# EAGLE board PoE_mag (EAGLE 6.4)
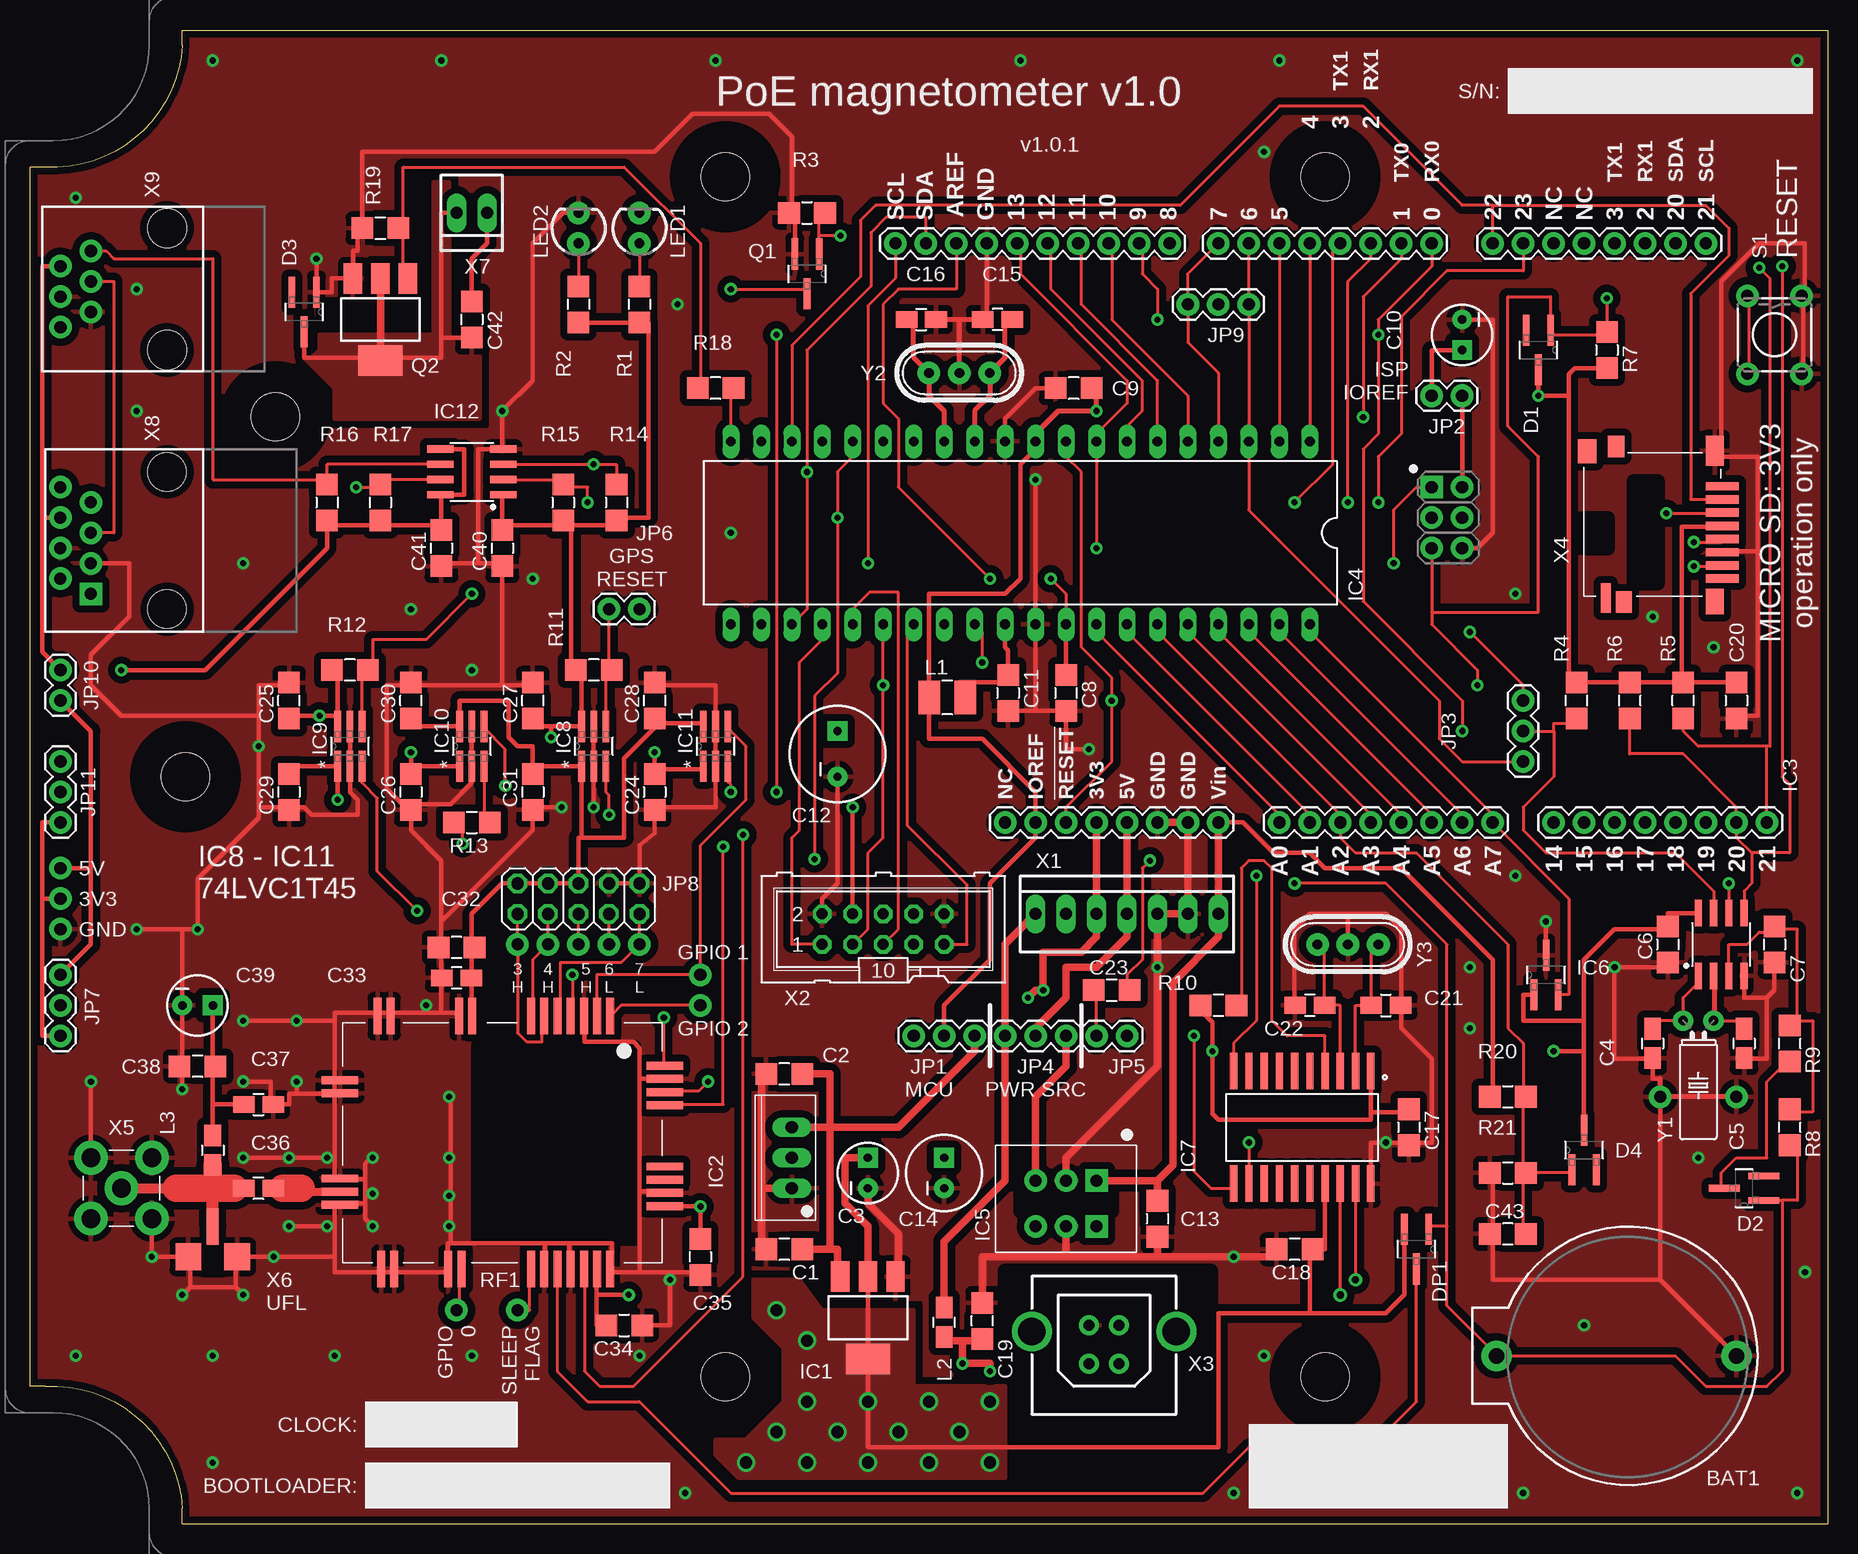
[diagram p3: board, top side]
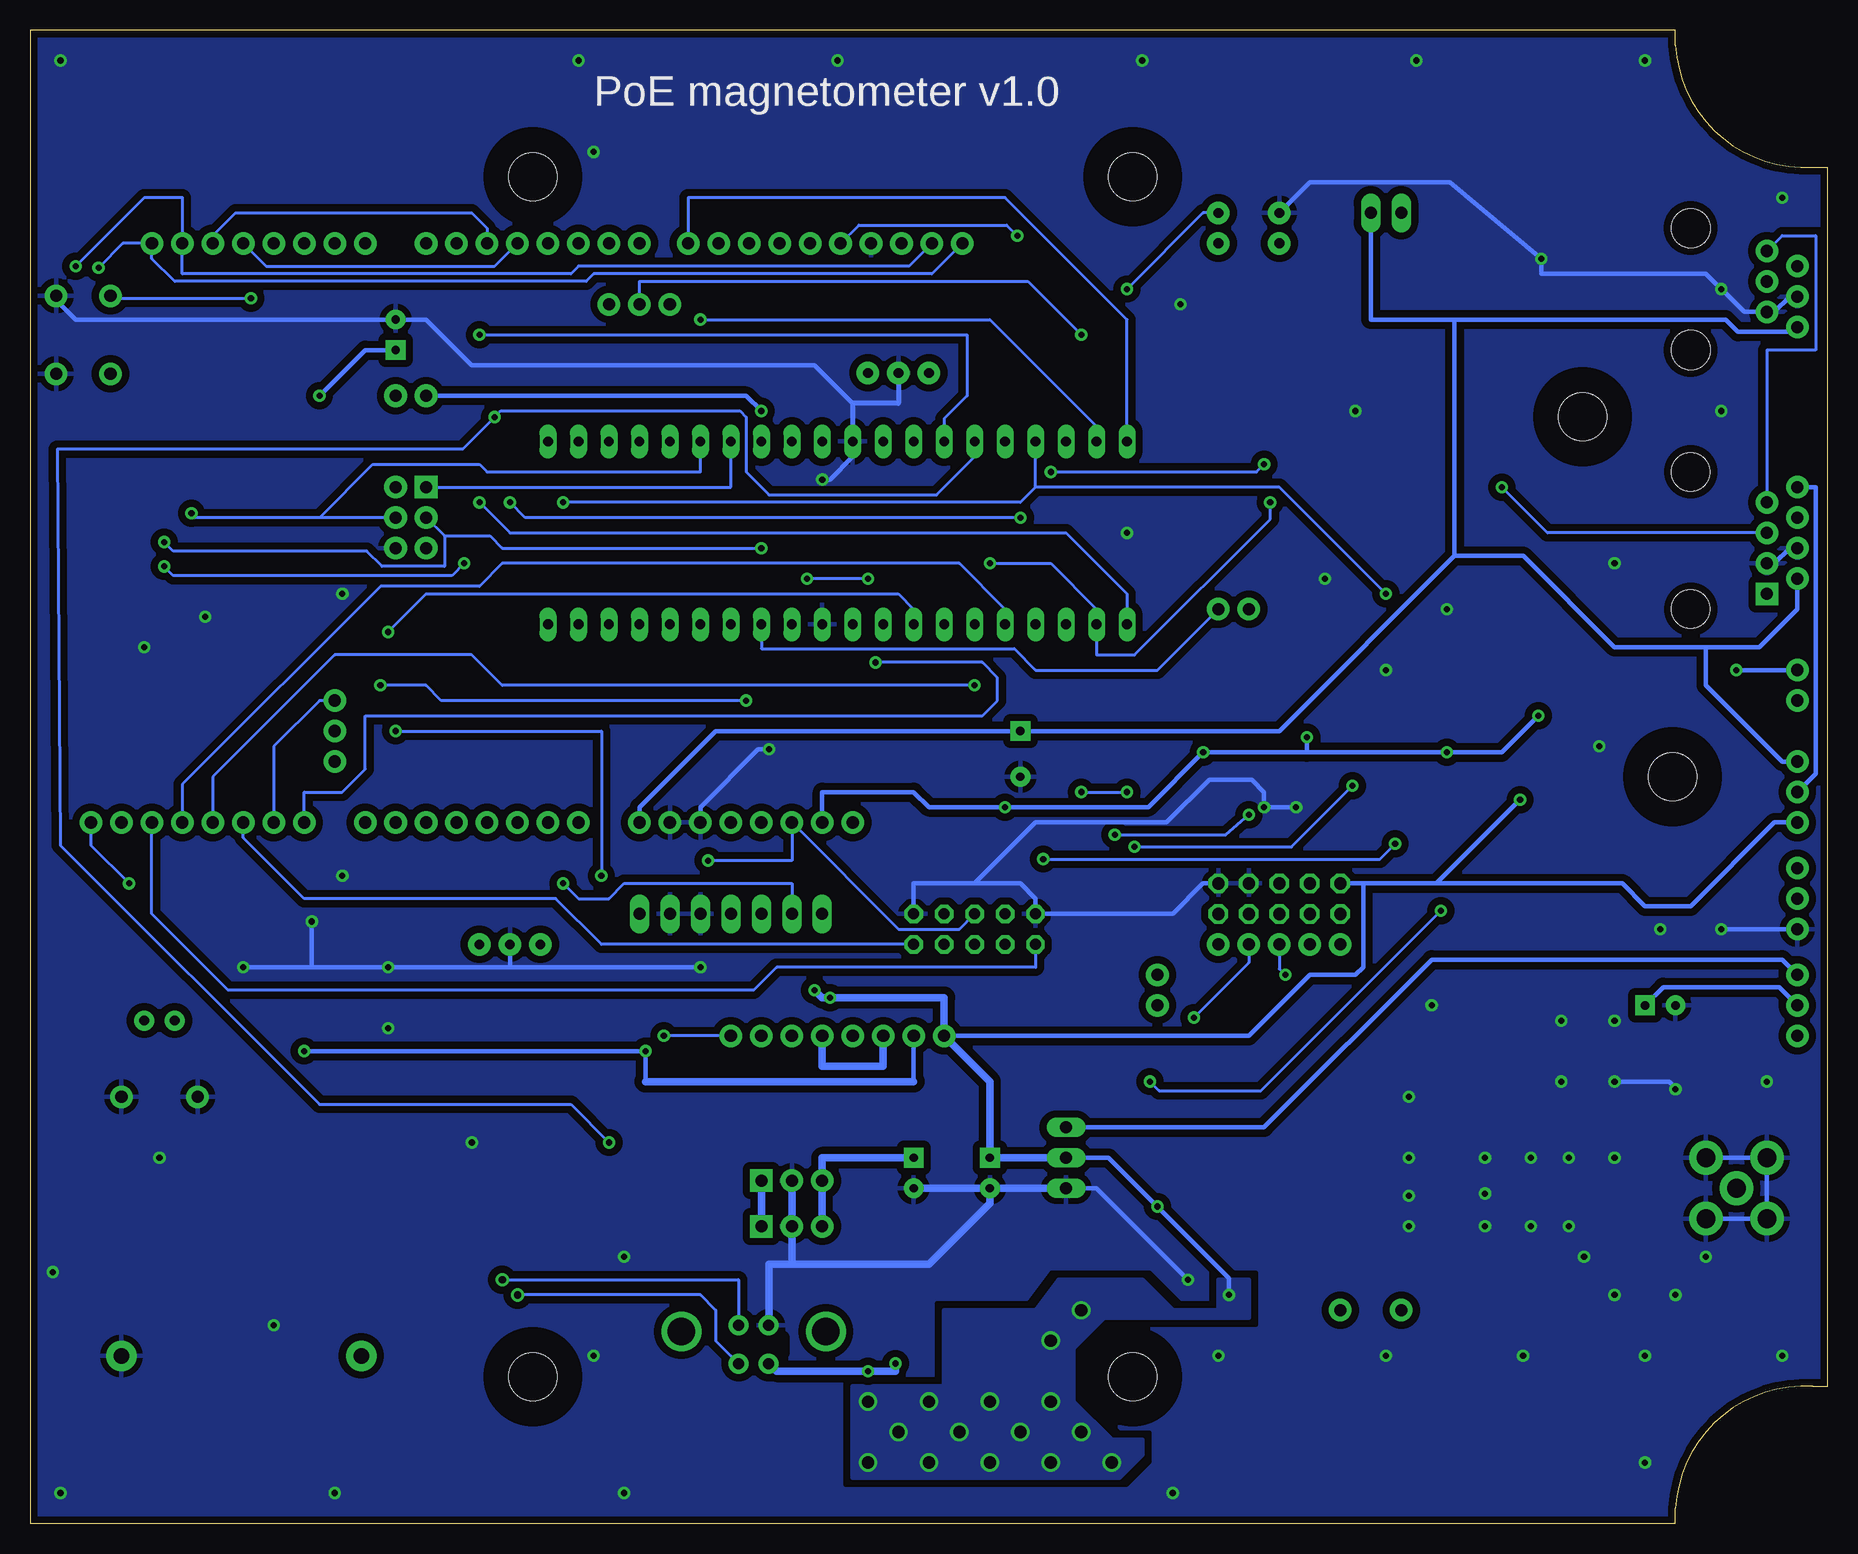
[diagram p4: board, bottom side, seen from below]

Size 149.86 x 124.46 mm. Coordinates in mm from the lower left corner, seen from the top.
Copper layers (1*16): Top 0.035mm / dielectric 1.5mm / Bottom 0.035mm
Design rules "SparkFun_Iteadstudio_10_12mil": minimum track width 10mil, minimum drill 20mil, track to track 12mil, track to pad 12mil, pad to pad 12mil, via to via 12mil, smd to smd 12mil, copper to edge 0.5mm, drill to drill 8mil, minimum pad ring 12mil, minimum via ring 10mil, stop-mask expansion 4mil, vias tented up to drill 25mil, thermal gap 20mil
Net classes: 1 power: width 0.381 mm; 2 antenna: width 0.66 mm
tRestrict: area 81.3,17.8 to 98.4,21.1; area 82.2,6.9 to 87,14; area 92.1,6.9 to 98.4,14; area 87,6.9 to 92.1,12.1; area 85.3,11.4 to 87.4,17.8; area 91.7,11.4 to 93.7,17.8; area 87.1,14.2 to 91.9,15.5; area 24.4,100.1 to 27.9,101.6; area 30.5,100.1 to 32.8,101.6
bRestrict: area 87.1,14.2 to 91.2,15.5

## Footprints (pad centres in the part's own frame; a part is rotated, then mirrored left to right if it is on the bottom)
BATTCOM_20MM_PTH = drill 1.3 pad 2.54: 1 20,0; 2 0,0
FIBOX-PC-M-95-G-POE-MAG = hole 4: 0,50; 0,-50; -50,-50; -50,50; -95,0; -87.5,30
1206-HAND = smd 1.8 x 1.803: 1 -1.499,0; 2 1.499,0
CPOL-RADIAL-10UF-25V = drill 0.7 pad 1.651 square: 1 1.27,0 | drill 0.7 pad 1.651: 2 -1.27,0
0805-HAND = smd 1.8 x 1.4: 1 -1.225,0; 2 1.225,0
CPOL-RADIAL-100UF-25V-150MIL = drill 0.7 pad 1.651 square: 1 1.905,0 | drill 0.7 pad 1.651: 2 -1.905,0
CPOL-RADIAL-100UF-16V = drill 0.7 pad 1.651 square: 1 1.27,0 | drill 0.7 pad 1.651: 2 -1.27,0
SOT23-3-HAND = smd 2.591 x 0.559: 1 -1.651,1.016; 2 -1.651,-1.016; 3 1.651,0
SOT223-HAND = smd 1.524 x 2.54: 1 -2.3,-3.429; 2 0,-3.429; 3 2.3,-3.429 | smd 3.683 x 2.54: 4 0,3.429
TO220 = drill 1.016 long: 1 -2.54,0; 2 0,0; 3 2.54,0
SO08 = smd 0.61 x 2.21: 1 -1.905,-2.616; 2 -0.635,-2.616; 3 0.635,-2.616; 4 1.905,-2.616; 5 1.905,2.616; 6 0.635,2.616; 7 -0.635,2.616; 8 -1.905,2.616
DIL40 = drill 0.813 long: 1 -24.13,-7.62; 2 -21.59,-7.62; 3 -19.05,-7.62; 4 -16.51,-7.62; 5 -13.97,-7.62; 6 -11.43,-7.62; 7 -8.89,-7.62; 8 -6.35,-7.62; 9 -3.81,-7.62; 10 -1.27,-7.62; 11 1.27,-7.62; 12 3.81,-7.62; 13 6.35,-7.62; 14 8.89,-7.62; 15 11.43,-7.62; 16 13.97,-7.62; 17 16.51,-7.62; 18 19.05,-7.62; 19 21.59,-7.62; 20 24.13,-7.62; 21 24.13,7.62; 22 21.59,7.62; 23 19.05,7.62; 24 16.51,7.62; 25 13.97,7.62; 26 11.43,7.62; 27 8.89,7.62; 28 6.35,7.62; 29 3.81,7.62; 30 1.27,7.62; 31 -1.27,7.62; 32 -3.81,7.62; 33 -6.35,7.62; 34 -8.89,7.62; 35 -11.43,7.62; 36 -13.97,7.62; 37 -16.51,7.62; 38 -19.05,7.62; 39 -21.59,7.62; 40 -24.13,7.62
TSR-1-XXXX/POWERPAX-P78XX-10 = drill 1 pad 1.88 square: 1@A -2.54,0; 1@B -2.54,3.81 | drill 1 pad 1.88: 2@A 0,0; 2@B 0,3.81; 3@A 2.54,0; 3@B 2.54,3.81
SO20 = smd 0.61 x 3.048: 1 -5.715,-4.699; 2 -4.445,-4.699; 3 -3.175,-4.699; 4 -1.905,-4.699; 5 -0.635,-4.699; 6 0.635,-4.699; 7 1.905,-4.699; 8 3.175,-4.699; 9 4.445,-4.699; 10 5.715,-4.699; 11 5.715,4.699; 12 4.445,4.699; 13 3.175,4.699; 14 1.905,4.699; 15 0.635,4.699; 16 -0.635,4.699; 17 -1.905,4.699; 18 -3.175,4.699; 19 -4.445,4.699; 20 -5.715,4.699
SOT23-6-HAND = smd 2.591 x 0.559: 1 -1.651,1.016; 2 -1.651,0; 3 -1.651,-1.016; 4 1.651,-1.016; 5 1.651,0; 6 1.651,1.016
1X03 = drill 1.016 pad 1.88: 1 0,0; 2 2.54,0; 3 5.08,0
1X02 = drill 1.016 pad 1.88: 1 0,0; 2 2.54,0
2X05 = drill 1.016 octagon: 1 -5.08,-1.27; 2 -5.08,1.27; 3 -2.54,-1.27; 4 -2.54,1.27; 5 0,-1.27; 6 0,1.27; 7 2.54,-1.27; 8 2.54,1.27; 9 5.08,-1.27; 10 5.08,1.27
1210-HAND = smd 1.8 x 2.794: 1 -1.499,0; 2 1.499,0
LED3MM = drill 0.813 pad 1.88: A -1.27,0; K 1.27,0
NVC08C-CSM-HAND = smd 0.66 x 3.048: P$1 -9,-10.535; P$2 -7.9,-10.535; P$3 -6.8,-10.535; P$4 -5.7,-10.535; P$5 -4.6,-10.535; P$6 -3.5,-10.535; P$7 -2.4,-10.535; P$8 2.5,-10.535; P$9 3.6,-10.535; P$10 9.3,-10.535; P$11 10.4,-10.535; P$17 10.1,10.535; P$18 9,10.535; P$19 4.5,10.535; P$20 3.4,10.535; P$21 -2.4,10.535; P$22 -3.5,10.535; P$23 -4.6,10.535; P$24 -5.7,10.535; P$25 -6.8,10.535; P$26 -7.9,10.535; P$27 -9,10.535 | smd 3.048 x 0.66: P$12 13.535,-5.2; P$13 13.535,-4.1; P$14 13.535,3; P$15 13.535,4.1; P$16 13.535,5.2; P$28 -13.535,5.3; P$29 -13.535,4.2; P$30 -13.535,3.1; P$31 -13.535,2; P$32 -13.535,-3.1; P$33 -13.535,-4.2; P$34 -13.535,-5.3; P$35 -13.535,-6.4
TACTILE-PTH = drill 1.016 pad 1.88: 1 -3.251,2.261; 2 3.251,2.261; 3 -3.251,-2.261; 4 3.251,-2.261
CALUNIUM-SHIELD-NO-OUTLINE-NO-HOLES-NO-TEXT-V3 = drill 1.016 pad 1.88: 0(RX0) 0,21.59; 1(TX0) -2.54,21.59; 2@0 -5.08,21.59; 2@1 17.78,21.59; 3.3V -27.94,-26.67; 3@0 -7.62,21.59; 3@1 15.24,21.59; 4 -10.16,21.59; 5 -12.7,21.59; 5V -25.4,-26.67; 6 -15.24,21.59; 7 -17.78,21.59; 8 -21.844,21.59; 9 -24.384,21.59; 10 -26.924,21.59; 11@0 -29.464,21.59; 12@0 -32.004,21.59; 13@0 -34.544,21.59; 14 10.16,-26.67; 15 12.7,-26.67; 16 15.24,-26.67; 17 17.78,-26.67; 18 20.32,-26.67; 19 22.86,-26.67; 20@0 25.4,-26.67; 20@1 20.32,21.59; 21@0 27.94,-26.67; 21@1 22.86,21.59; 22 5.08,21.59; 23 7.62,21.59; !ISP_RESET 0,-3.81; !RESET@0 -30.48,-26.67; A0 -12.7,-26.67; A1 -10.16,-26.67; A2 -7.62,-26.67; A3 -5.08,-26.67; A4/SDA -2.54,-26.67; A5/SCL 0,-26.67; A6 2.54,-26.67; A7 5.08,-26.67; AREF -39.624,21.59; GND@0 -22.86,-26.67; GND@1 -20.32,-26.67; GND@2 -37.084,21.59; GND@3 2.54,-3.81; IOREF -33.02,-26.67; ISP_MOSI 2.54,-1.27; ISP_SCK 0,-1.27; ISP_VCC 2.54,1.27; NC -35.56,-26.67; NC@0 12.7,21.59; NC@1 10.16,21.59; SCL -44.704,21.59; SDA -42.164,21.59; VIN -17.78,-26.67 | drill 1.016 pad 1.88 square: ISP_MISO 0,1.27
PAD = drill 1.016 pad 1.88: 1 0,0
22-23-2071 = drill 1 long: 1 -7.62,0; 2 -5.08,0; 3 -2.54,0; 4 0,0; 5 2.54,0; 6 5.08,0; 7 7.62,0
CON-HARTING-ML10 = drill 0.914 octagon: 1 -5.08,-1.27; 2 -5.08,1.27; 3 -2.54,-1.27; 4 -2.54,1.27; 5 0,-1.27; 6 0,1.27; 7 2.54,-1.27; 8 2.54,1.27; 9 5.08,-1.27; 10 5.08,1.27
USB-B-PTH-VERTICAL = drill 0.92 pad 1.676: D+ -1.25,0; D- -1.25,3.2; GND 1.25,0; VBUS 1.25,3.2 | drill 2.3: P$1 -6.02,0.5; P$2 6.02,0.5
MICRO-SD-SOCKET-HIROSE-DM3D = smd 0.7 x 2.75: CD/DAT3 6.6,-1.375; CLK 3.3,-1.375; CMD 5.5,-1.375; DAT0 1.1,-1.375; DAT1 0,-1.375; DAT2 7.7,-1.375; GND 2.2,-1.375; VDD 4.4,-1.375 | smd 1.8 x 1.3: P$11 -1.95,6.85 | smd 2.45 x 0.8: P$12 -1.625,8.35 | smd 1.8 x 1.4: P$13 11,7.5 | smd 2 x 1.55: P$14 10.6,9.925 | smd 2.5 x 1.5: SHIELD@0 10.65,-0.75 | smd 2.1 x 1.5: SHIELD@1 -1.9,-0.75
SMA-THD = drill 1.549 pad 2.794: GND@0 -2.54,2.54; GND@1 2.54,2.54; GND@2 2.54,-2.54; GND@3 -2.54,-2.54; SIG 0,0
CONN-UFL-HAND-SOLDERING = smd 2.134 x 2.235: GND@0 -2.032,0; GND@1 2.032,0 | smd 1.016 x 3.048: SIGNAL 0,-2.54
22-23-2021 = drill 1 long: 1 -1.27,0; 2 1.27,0
RJ45-8 = drill 1 pad 1.88 square: 1 -4.445,6.35 | drill 1 pad 1.88: 2 -3.175,8.89; 3 -1.905,6.35; 4 -0.635,8.89; 5 0.635,6.35; 6 1.905,8.89; 7 3.175,6.35; 8 4.445,8.89 | hole 3.2: -5.715,0; 5.715,0
RJ11-6 = drill 1.016 pad 1.88: 1 1.905,8.89; 2 3.175,6.35; 3 4.445,8.89; 4 5.715,6.35; 5 6.985,8.89; 6 8.255,6.35 | hole 3.251: 0,0; 10.16,0
TC38H = drill 0.813 pad 1.676: 1 -1.27,0; 2 1.27,0
HC49U-V-RESONATOR = drill 0.813 pad 1.88: 1 -2.54,0; 2 2.54,0; GND 0,0

## Placement (x,y rotation side)
BAT1  CR2032  [BATTCOM_20MM_PTH]  142.24,13.97 180 top
BOX1  BOXPOE-MAG-150-150  [FIBOX-PC-M-95-G-POE-MAG]  107.95,62.23 0 top
C1  1u  [1206-HAND]  62.87,22.86 180 top
C2  1u*  [1206-HAND]  62.87,37.46 180 top
C3  10u  [CPOL-RADIAL-10UF-25V]  69.85,29.21 90 top
C4  15p*  [0805-HAND]  135.25,40 270 top
C5  15p*  [0805-HAND]  142.88,40 270 top
C6  100n  [1206-HAND]  136.53,48.26 270 top
C7  100p*  [1206-HAND]  145.41,48.26 270 top
C8  100n  [1206-HAND]  86.36,69.22 270 top
C9  100n  [1206-HAND]  87,94.62 180 top
C10  10u  [CPOL-RADIAL-10UF-25V]  119.38,99.06 270 top
C11  100n  [1206-HAND]  81.53,69.22 270 top
C12  100u 25V  [CPOL-RADIAL-100UF-25V-150MIL]  67.31,64.13 90 top
C13  1u  [1206-HAND]  93.98,25.4 270 top
C14  100u  [CPOL-RADIAL-100UF-16V]  76.2,29.21 90 top
C15  22p  [0805-HAND]  80.64,100.33 180 top
C16  22p  [0805-HAND]  74.3,100.33 0 top
C17  100n  [1206-HAND]  114.94,33.02 270 top
C18  100n  [1206-HAND]  105.41,22.86 180 top
C19  10n  [1206-HAND]  79.38,16.89 90 top
C20  100n  [1206-HAND]  142.24,68.58 270 top
C21  22p  [0805-HAND]  113.03,43.18 0 top
C22  22p  [0805-HAND]  106.68,43.18 180 top
C23  100n  [1206-HAND]  90.17,44.45 0 top
C24  100n  [1206-HAND]  52.07,60.96 270 top
C25  100n  [1206-HAND]  21.59,68.58 90 top
C26  100n  [1206-HAND]  31.75,60.96 270 top
C27  100n  [1206-HAND]  41.91,68.58 90 top
C28  100n  [1206-HAND]  52.07,68.58 90 top
C29  100n  [1206-HAND]  21.59,60.96 270 top
C30  100n  [1206-HAND]  31.75,68.58 90 top
C31  100n  [1206-HAND]  41.91,60.96 270 top
C32  1u  [1206-HAND]  35.56,48.01 180 top
C33  22p  [0805-HAND]  35.56,45.47 180 top
C34  1u  [1206-HAND]  49.53,16.51 0 top
C35  1u  [1206-HAND]  55.88,22.22 270 top
C36  22p  [0805-HAND]  19.05,27.94 180 top
C37  22p  [0805-HAND]  19.05,34.92 0 top
C38  1u  [1206-HAND]  13.97,38.1 180 top
C39  10u  [CPOL-RADIAL-10UF-25V]  13.97,43.18 0 top
C40  100n  [1206-HAND]  39.37,81.28 270 top
C41  100n  [1206-HAND]  34.29,81.28 270 top
C42  1u  [1206-HAND]  36.83,100.33 270 top
C43  100n  [1206-HAND]  123.19,24.13 180 top
D1  BAS40  [SOT23-3-HAND]  125.73,97.79 270 top
D2  BAS40*  [SOT23-3-HAND]  142.88,27.94 180 top
D3  BAS21  [SOT23-3-HAND]  22.86,100.97 270 top
D4  BAS40  [SOT23-3-HAND]  129.54,31.11 90 top
DP1  BAS40-05  [SOT23-3-HAND]  115.57,22.86 270 top
IC1  LD1117V33  [SOT223-HAND]  69.85,17.14 180 top
IC2  LD1117V33*  [TO220]  63.5,30.48 90 top
IC3  DS1338  [SO08]  140.97,48.26 0 top
IC4  ATMEGA1284  [DIL40]  82.55,82.55 180 top
IC5  TSR 1-2450  [TSR-1-XXXX/POWERPAX-P78XX-10]  86.36,28.57 180 top
IC6  LM61  [SOT23-3-HAND]  126.36,45.72 90 top
IC7  MCP2200  [SO20]  106.05,33.02 180 top
IC8  74LVC1T45SOT23-HAND  [SOT23-6-HAND]  46.99,64.77 90 top
IC9  74LVC1T45SOT23-HAND  [SOT23-6-HAND]  26.67,64.77 90 top
IC10  74LVC1T45SOT23-HAND  [SOT23-6-HAND]  36.83,64.77 90 top
IC11  74LVC1T45SOT23-HAND  [SOT23-6-HAND]  57.15,64.77 90 top
IC12  PCA9517A  [SO08]  36.83,87.63 90 top
JP1  3V3/5V  [1X03]  73.66,40.64 0 top
JP2  ISP IOREF  [1X02]  119.38,93.98 180 top
JP3  SQW  [1X03]  124.46,68.58 270 top
JP4  USB/VIN  [1X03]  86.36,40.64 180 top
JP5  AUTO RST  [1X02]  91.44,40.64 180 top
JP6  GPS !RESET! (A0)  [1X02]  50.8,76.2 180 top
JP7  V ANT  [1X03]  2.54,45.72 270 top
JP8  CONFIG  [2X05]  45.72,52.07 0 top
JP9  PPS  [1X03]  96.52,101.6 0 top
JP10  5V LINK  [1X02]  2.54,68.58 90 top
JP11  MAG VCC  [1X03]  2.54,63.5 270 top
L1  10uH  [1210-HAND]  76.45,68.83 180 top
L2  FERRITE  [0805-HAND]  76.2,16.76 90 top
L3  47n  [0805-HAND]  15.24,31.11 270 top
LED1  D13  [LED3MM]  50.8,107.95 90 top
LED2  PWR  [LED3MM]  45.72,107.95 90 top
Q1  BSS138  [SOT23-3-HAND]  64.77,104.14 270 top
Q2  BUK98150-55A  [SOT223-HAND]  29.21,100.33 180 top
R1  560R  [1206-HAND]  50.8,101.6 270 top
R2  560R  [1206-HAND]  45.72,101.6 270 top
R3  1M  [1206-HAND]  64.77,109.22 0 top
R4  10k  [1206-HAND]  128.91,68.58 90 top
R5  4k7  [1206-HAND]  137.79,68.58 90 top
R6  4k7  [1206-HAND]  133.35,68.58 90 top
R7  10k  [1206-HAND]  131.44,97.79 270 top
R8  0R  [1206-HAND]  146.69,33.02 90 top
R9  1k*  [1206-HAND]  146.69,40 90 top
R10  1k  [1206-HAND]  99.06,43.18 180 top
R11  10k  [1206-HAND]  46.99,71.12 180 top
R12  100k  [1206-HAND]  26.67,71.12 180 top
R13  10k  [1206-HAND]  36.83,58.42 0 top
R14  4k7  [1206-HAND]  48.9,85.09 270 top
R15  4k7  [1206-HAND]  44.45,85.09 270 top
R16  4k7  [1206-HAND]  24.77,85.09 270 top
R17  4k7  [1206-HAND]  29.21,85.09 270 top
R18  330R  [1206-HAND]  57.15,94.62 180 top
R19  1M  [1206-HAND]  29.21,107.95 0 top
R20  3k 1%  [1206-HAND]  123.19,35.56 0 top
R21  1k 1%  [1206-HAND]  123.19,29.21 0 top
RF1  NV08C-CSM  [NVC08C-CSM-HAND]  39.37,31.75 180 top
S1  RESET  [TACTILE-PTH]  145.41,99.06 270 top
U$1  CALUNIUM-SHIELD-V3V3-NO-HOLES-NO-TEXT  [CALUNIUM-SHIELD-NO-OUTLINE-NO-HOLES-NO-TEXT-V3]  116.84,85.09 0 top
U$2  PAD  [PAD]  2.54,49.53 0 top
U$3  PAD  [PAD]  2.54,52.07 0 top
U$4  PAD  [PAD]  2.54,54.61 0 top
U$5  PAD  [PAD]  40.64,17.78 270 top
U$6  PAD  [PAD]  35.56,17.78 270 top
U$7  PAD  [PAD]  55.88,45.72 270 top
U$8  ?  [PAD]  55.88,43.18 270 top
U$9  PAD  [PAD]  40.64,48.26 270 top
U$10  PAD  [PAD]  43.18,48.26 270 top
U$11  PAD  [PAD]  45.72,48.26 270 top
U$12  PAD  [PAD]  48.26,48.26 270 top
U$13  PAD  [PAD]  50.8,48.26 270 top
U$14  PAD  [PAD]  142.24,35.56 0 top
U$15  PAD  [PAD]  135.89,35.56 0 top
X1  PWR  [22-23-2071]  91.44,50.8 0 top
X2  JTAG  [CON-HARTING-ML10]  71.12,49.53 0 top
X3  USB  [USB-B-PTH-VERTICAL]  89.53,16.51 180 top
X4  MICRO-SD-SOCKETHIROSE-DM3D  [MICRO-SD-SOCKET-HIROSE-DM3D]  139.7,78.74 90 top
X5  CONN-SMATHD  [SMA-THD]  7.62,27.94 270 top
X6  UFL  [CONN-UFL-HAND-SOLDERING]  15.24,22.22 180 top
X7  22-23-2021  [22-23-2021]  36.83,109.22 180 top
X8  RJ45*  [RJ45-8]  11.43,81.91 90 top
X9  RJ11  [RJ11-6]  11.43,97.79 90 top
Y1  32k768  [TC38H]  139.06,41.91 180 top
Y2  12MHz  [HC49U-V-RESONATOR]  77.47,95.88 180 top
Y3  12MHz  [HC49U-V-RESONATOR]  109.86,48.26 180 top

## Tracks (layer width: path | path; a pad name or v marks a point on that pad's centre or on a via)
0(RX0)  (via drill 0.51)
  Top 0.254: U$1.0(RX0) 116.84,104.78 112.39,100.33 v112.39,99.06 112.39,90.81 111.12,89.53 111.12,76.84 119.38,68.58 v119.38,66.04 | IC7.10 100.33,40 102.23,41.91 v102.23,53.97
  Bottom 0.254: IC4.14 73.66,92.07 71.75,93.98 71.75,99.06 v112.39,99.06 | v102.23,53.97 102.23,66.04 v119.38,66.04
1(TX0)  (via drill 0.51)
  Top 0.254: v111.12,92.2 111.12,102.23 114.3,105.41 U$1.1(TX0) | v101.6,31.75 IC7.12
  Bottom 0.254: IC4.15 71.12,88.9 74.3,85.72 88.27,85.72 90.17,87.63 90.17,92.2 90.68,92.71 110.62,92.71 v111.12,92.2 113.79,89.53 147.57,89.53 147.32,56.51 125.73,34.92 104.78,34.92 v101.6,31.75
2(RX1)  (via drill 0.51)
  Top 0.254: v36.07,56.64 36.07,57.91 35.56,58.42 R13.1 | v65.41,55.37 65.41,68.96 67.31,70.87 v67.31,83.82 67.31,87.63 68.58,88.9 IC4.16 | U$1.2@0 111.76,105.41 109.86,103.5 v109.86,85.09
  Bottom 0.254: U$1.2@0 111.76,107.95 113.03,109.22 132.72,109.22 134.62,107.31 U$1.2@1 | v36.07,56.64 37.34,55.37 v65.41,55.37 | v109.86,85.09 108.58,83.82 v67.31,83.82
3(TX1)  (via drill 0.51)
  Top 0.254: 27.94,71.12 27.69,70.87 IC9.4 | v36.83,77.47 33.02,73.66 28.57,73.66 28.57,71.12 R12.1 | U$1.3@0 108.58,106.04 108.58,88.26 v105.41,85.09
  Top 0.381: R12.1 27.94,71.12
  Bottom 0.254: U$1.3@0 111.12,104.78 130.18,104.78 U$1.3@1 | 66.04,86.36 IC4.17 | 66.04,86.36 45.72,86.36 v36.83,77.47 | v105.41,85.09 67.31,85.09 66.04,86.36
4
  Top 0.254: U$1.4 IC4.1
5
  Top 0.254: U$1.5 IC4.2
6
  Top 0.254: U$1.6 JP9.3 IC4.3 101.6,84.45 117.47,68.58 117.47,65.41 119.38,63.5 JP3.3
7
  Top 0.254: IC4.4 99.06,95.88 96.52,98.42 JP9.1 96.52,104.14 U$1.7
8
  Top 0.254: IC4.20 58.42,94.49 R18.1
  Bottom 0.254: U$1.8 95,110.49 68.58,110.49 58.42,100.33 IC4.20
9  (via drill 0.51)
  Top 0.254: U$1.9 92.71,106.43 92.71,104.14 93.98,102.87 v93.98,100.33
  Bottom 0.254: IC4.19 60.96,91.44 69.85,100.33 v93.98,100.33
10
  Top 0.254: IC4.5 96.52,93.98 90.17,100.33 90.17,106.43 U$1.10
11(MOSI)  (via drill 0.51)
  Top 0.254: v136.4,84.2 140.97,84.2 X4.CMD | U$1.11@0 87.63,106.43 87.63,101.6 93.98,95.25 IC4.6
  Bottom 0.254: v136.4,84.2 136.14,83.82 125.73,83.82 | U$1.ISP_MOSI 125.73,83.82 | IC4.6 93.98,87.63 111.76,87.63 112.39,88.26 121.28,88.26 125.73,83.82
12(MISO)  (via drill 0.51)
  Top 0.254: v138.68,79.76 140.97,79.76 X4.DAT0 | v113.67,80.01 113.67,84.45 115.57,86.36 U$1.ISP_MISO | U$1.12@0 85.09,106.43 85.09,102.87 92.71,95.25 92.71,92.71 91.44,91.44 IC4.7
  Bottom 0.254: v138.68,79.76 137.92,78.99 114.68,78.99 v113.67,80.01 | IC4.7 91.44,86.36 U$1.ISP_MISO
13(SCK)  (via drill 0.51)
  Top 0.254: v138.68,81.79 140.97,81.79 X4.CLK | Q1.1 65.79,107.31 | U$1.13@0 82.55,106.43 82.55,104.14 91.44,95.25 91.44,93.34 88.9,90.81 IC4.8 v88.9,81.28 | v67.56,107.31 65.79,107.31 | 65.79,107.31 65.79,109.22 R3.2
  Bottom 0.254: v138.68,81.79 137.92,81.03 121.79,81.03 120.52,79.76 115.32,79.76 115.32,82.3 | v67.56,107.31 68.45,108.2 80.77,108.2 U$1.13@0 | 115.32,82.3 111.51,82.3 110.49,81.28 v88.9,81.28 | 115.32,82.3 U$1.ISP_SCK
14  (via drill 0.51)
  Top 0.254: IC4.29 79.38,74.29 v79.38,71.75
  Bottom 0.254: v79.38,71.75 70.48,71.75 69.22,70.48 69.22,68.58 70.48,67.31 121.92,67.31 121.92,62.86 123.83,60.96 127,60.96 U$1.14
15  (via drill 0.51)
  Top 0.254: JP3.1 124.46,69.85 v120.02,74.29
  Bottom 0.254: IC4.28 76.2,76.2 77.47,77.47 116.84,77.47 v120.02,74.29 | U$1.15 129.54,64.77 125.73,68.58 JP3.1
16(TDI)
  Top 0.254: IC4.27 73.15,74.42 73.15,58.17 78.11,53.21 78.11,48.26 X2.9
  Bottom 0.254: U$1.16 132.08,57.15 127,52.07 106.05,52.07 102.23,48.26 X2.9
17(TDO)  (via drill 0.51)
  Top 0.254: IC4.26 v71.12,69.85 71.12,57.15 69.85,55.88 69.85,49.53 X2.3
  Bottom 0.254: U$1.17 134.62,62.23 124.46,72.39 113.03,72.39 110.49,69.85 v71.12,69.85
18(TMS)
  Top 0.254: IC4.25 68.58,76.2 69.98,77.6 72.39,77.6 72.39,49.53 X2.5
  Bottom 0.254: U$1.18 137.16,61.59 120.65,78.1 112.39,78.1 110.49,80.01 72.39,80.01 68.58,76.2 IC4.25
19(TCK)
  Top 0.254: IC4.24 66.04,73.66 64.14,71.75 64.14,57.78 63.5,57.15 63.5,48.26 X2.1
  Bottom 0.254: U$1.19 139.7,50.8 133.35,44.45 89.53,44.45 87.63,46.35 66.04,46.35 X2.1
20(SDA)  (via drill 0.51)
  Top 0.254: 133.35,67.31 R6.1 133.35,64.13 137.79,64.13 142.24,59.69 U$1.20@0 142.24,57.15 143.51,55.88 | 143.51,55.88 143.51,53.34 142.88,52.7 IC3.5 | IC12.3 v46.99,88.26 48.9,88.26 48.9,86.61 48.26,86.61 R14.1 | IC4.23 64.77,76.2 v64.77,87.63 64.77,97.79 70.1,103.12 70.1,107.57 71.37,108.84 74.68,108.84 U$1.SDA | 143.51,55.88 146.69,55.88 146.69,61.59 146.05,62.23 v146.05,104.78
  Bottom 0.254: U$1.SDA 76.58,104.78 104.14,104.78 104.78,104.14 137.16,104.14 U$1.20@1 137.16,110.49 140.34,110.49 v146.05,104.78 | v46.99,88.26 47.62,87.63 v64.77,87.63
21(SCL)  (via drill 0.51)
  Top 0.254: U$1.21@0 144.78,64.77 | 144.78,64.77 139.06,64.77 137.79,66.04 R5.1 | v141.6,53.34 141.6,50.8 141.73,51.05 IC3.6 | IC12.2 39.62,86.87 39.62,87 44.45,87 R15.1 44.45,86.36 46.48,86.36 v46.48,85.09 | v69.85,80.01 69.85,101.47 72.14,103.76 U$1.SCL | 144.78,64.77 145.03,64.77 145.03,103.76 v144.15,104.65
  Bottom 0.254: U$1.21@0 144.78,56.51 v141.6,53.34 | v69.85,80.01 64.77,80.01 60.96,76.2 IC4.22 60.96,72.39 57.78,72.39 46.48,83.69 v46.48,85.09 | U$1.SCL 74.68,104.14 102.87,104.14 103.5,103.5 137.79,103.5 139.7,105.41 U$1.21@1 142.11,106.68 v144.15,104.65
22
  Top 0.254: 121.92,109.85 139.7,109.85 141.6,107.95 141.6,105.66 138.43,102.49 138.43,85.34 140.97,85.34 X4.CD/DAT3 | U$1.22 121.92,109.85 | IC4.18 63.5,98.17 69.22,103.89 69.22,108.59 70.48,109.85 95.89,109.85 104.14,118.11 111.12,118.11 119.38,109.85 121.92,109.85
23  (via drill 0.51)
  Top 0.254: v112.39,85.09 112.39,88.9 114.3,90.81 114.3,100.58 118.11,104.39 124.46,104.39 U$1.23
  Bottom 0.254: IC4.21 58.42,77.47 63.5,82.55 109.86,82.55 v112.39,85.09
!GPS_RESET  (via drill 0.51)
  Top 0.254: v48.26,59.05 48.26,60.71 48.01,60.96 IC8.3 | v59.44,57.4 59.44,20.57 50.29,11.43 47.5,11.43 46.23,12.7 46.23,21.08 RF1.P$25
  Bottom 0.254: v48.26,59.05 50.16,57.4 v59.44,57.4
!MCP2200_RESET
  Top 0.254: R10.1 100.97,43.18 100.97,54.61 101.6,55.24 102.87,55.24 103.5,54.61 103.5,41.91 104.78,40.64 107.95,40.64 IC7.4
!RESET  (via drill 0.51)
  Top 0.254: v131.44,102.11 R7.1 131.44,99.06 126.75,99.06 D1.1 126.75,102.23 123.19,102.23 123.19,91.44 125.73,88.9 125.73,75.95 116.84,75.95 | S1.4 143.26,96.01 143.26,102.11 S1.3 | v93.34,55.24 92.71,54.61 92.71,46.99 91.44,45.72 91.44,43.81 C23.2 | IC4.9 86.36,88.9 87.63,87.63 87.63,73.03 90.17,70.48 v90.17,68.58 90.17,63.5 86.36,59.69 U$1.!RESET@0 | 116.84,75.95 116.84,74.93 120.65,71.12 v120.65,69.85 | U$1.!ISP_RESET 116.84,75.95
  Bottom 0.254: v131.44,102.11 143,102.11 S1.3 | v93.34,55.24 86.36,55.24 U$1.!RESET@0 77.47,49.53 72.39,49.53 X2.6 | v90.17,68.58 115.57,68.58 116.84,69.85 v120.65,69.85
+3V3  (via drill 0.51, 1.02)
  Top 0.381: 36.83,48.26 36.83,45.72 | 36.83,45.72 36.83,42.42 RF1.P$8 | 36.83,45.72 C33.1 | RF1.P$26 47.24,21.21 47.24,19.05 | 47.24,19.05 47.24,16.51 C34.1 | IC7.17 107.95,22.86 C18.1 106.68,22.86 106.68,17.53 | C29.1 21.59,63.12 IC9.1 v25.65,60.32 | C30.1 31.75,66.42 IC10.6 35.81,68.58 39.88,68.58 39.88,65.53 40.64,64.77 41.91,64.77 C31.1 41.91,63.12 IC8.1 45.97,57.15 | IC11.6 56.13,66.67 52.07,66.67 | RF1.P$28 55.88,26.45 v55.88,26.42 C35.1 | JP7.3 1.02,40.64 1.02,52.07 | U$3.1 1.02,52.07 | JP11.3 1.02,58.42 1.02,52.07 | 45.97,57.15 45.72,57.15 JP8.6 JP8.4 JP8.2 39.37,53.34 36.83,50.8 36.83,48.26 | 45.97,57.15 49.53,57.15 49.53,63.75 52.07,66.29 52.07,66.67 | 52.07,66.67 C28.1 | 36.83,48.26 C32.1 | 106.68,17.53 113.03,17.53 114.55,19.05 DP1.2 | IC1.2 IC1.4 69.85,6.35 99.06,6.35 99.06,17.53 106.68,17.53 | v49.91,19.05 47.24,19.05
  Top 0.61: U$1.3.3V X1.3 88.9,48.89 87.63,47.62 84.45,47.62 v84.45,44.45 83.82,44.45 v83.19,43.81 | IC1.2 69.85,24.76 67.94,26.67 67.94,30.48 C3.1
  Bottom 0.381: 32.64,53.34 v25.65,60.32 | JP8.2 38.73,53.34 | 38.73,53.34 32.64,53.34 | 32.64,53.34 17.14,53.34 15.24,51.43 11.43,51.43 4.45,58.42 JP11.3 | v49.91,19.05 49.91,20.45 v55.88,26.42 59.94,30.48 IC2.2 | 38.73,53.34 38.73,46.35 39.37,45.72 43.18,45.72 48.26,40.64 JP1.1
  Bottom 0.61: IC2.2 C3.1 69.85,36.83 JP1.1 73.66,43.81 83.82,43.81 v84.45,44.45
  other vias: 77.47,7.62 64.77,15.24 64.77,5.08 74.93,5.08 80.01,5.08 80.01,10.16 72.39,7.62 74.93,10.16 64.77,10.16 69.85,5.08 69.85,10.16 67.31,7.62 62.23,7.62 59.69,5.08 62.23,17.78
  pour Bottom (isolate 0.61): 62.87,14.6 60.33,17.14 48.26,17.14 48.26,20.32 50.8,20.32 50.8,17.78 54.61,17.78 57.15,20.32 64.14,20.32 66.04,17.78 73.66,17.78 73.66,11.43 81.28,11.43 81.28,3.81 59.05,3.81 57.15,5.71 57.15,6.98 59.69,6.98 62.87,10.16
  pour Top (isolate 0.61): 62.87,14.6 60.33,17.14 60.33,20.32 64.14,20.32 66.04,17.78 73.66,17.78 73.66,11.43 81.28,11.43 81.28,3.81 59.05,3.81 57.15,5.71 57.15,6.98 59.69,6.98 62.87,10.16
+5V
  Top 0.381: 67.31,20.57 IC1.3 | JP7.1 5.08,48.26 5.08,54.61 | U$4.1 5.08,54.61 | JP10.1 5.08,66.04 5.08,54.61
  Top 0.61: 66.67,33.02 66.67,37.46 C2.1 | C1.1 66.67,22.86 | 66.67,22.86 67.31,22.86 67.31,20.57 | U$1.5V X1.4 91.44,48.89 88.9,46.35 86.36,46.35 86.36,43.81 83.82,41.27 JP4.2 | 66.67,33.02 66.67,22.86 | IC2.3 66.67,33.02 | JP1.3 78.74,39.37 72.39,33.02 66.67,33.02
  Bottom 0.381: JP7.1 3.81,46.99 33.02,46.99 46.99,33.02 IC2.3
  Bottom 0.61: JP4.2 83.82,38.1 78.74,38.1 JP1.3
+5V_USB
  Top 0.61: L2.2 76.2,23.49 81.28,28.57 JP4.3 81.28,48.26 X1.1
A0
  Top 0.254: U$1.A0 104.14,59.05 88.9,74.29 IC4.33
  Bottom 0.254: JP6.1 55.88,71.12 66.04,71.12 67.82,72.9 88.9,72.9 IC4.33
A1
  Top 0.254: U$1.A1 106.68,59.05 91.44,74.29 IC4.34
A2
  Top 0.254: IC4.35 93.98,74.29 109.22,59.05 U$1.A2 109.22,57.15 110.49,55.88 115.57,55.88 123.19,48.26 123.19,41.27 124.46,40 124.46,35.56 | D4.1 128.52,29.21 R21.2 124.46,29.21 | 124.46,29.21 124.46,35.56 | 124.46,35.56 R20.2 125.09,35.56 | C43.1 124.46,24.13 124.46,29.21
A3
  Top 0.254: U$1.A3 111.76,59.05 96.52,74.29 IC4.36
A4
  Top 0.254: U$1.A4/SDA 114.3,59.05 99.06,74.29 IC4.37
A5
  Top 0.254: U$1.A5/SCL 116.84,59.05 101.6,74.29 IC4.38
A6
  Top 0.254: U$1.A6 119.38,59.05 104.14,74.29 IC4.39
A7
  Top 0.254: IC4.40 106.68,74.29 121.92,59.05 U$1.A7 128.27,52.07 128.27,44.07 IC6.2
AREF  (via drill 0.51)
  Top 0.254: IC4.32 86.36,77.47 v85.09,78.74 | v80.01,78.74 72.39,86.36 72.39,92.07 71.12,93.34 71.12,101.6 72.39,102.87 77.22,102.87 U$1.AREF
  Top 0.381: IC4.32 C8.1 86.36,70.48
  Bottom 0.254: v80.01,78.74 v85.09,78.74
AUTO_RESET  (via drill 0.51)
  Top 0.254: v97.03,40.64 97.03,29.34 98.42,27.94 100.33,27.94 IC7.11
  Bottom 0.254: JP5.1 v97.03,40.64
AVCC
  Top 0.381: IC4.30 81.28,73.03 81.53,72.77 C11.1 81.28,70.1 77.47,70.1 77.47,69.85 L1.1 78.11,69.85
FAN_CTRL
  Top 0.381: 29.21,97.16 Q2.4 29.21,97.03 | 29.21,97.16 22.86,97.16 D3.3 | 34.29,98.81 34.29,109.22 X7.2 | 29.21,97.16 34.29,97.16 34.29,98.81 | 34.29,98.81 36.83,98.81 C42.2
  Top 0.61: 29.21,97.16 Q2.2
  pour Top (isolate 0.61): 22.86,97.16 23.5,97.16 24.13,97.79 24.13,99.06 33.66,99.06 33.66,111.76 34.92,111.76 34.92,98.81 37.47,98.81 37.47,92.07 25.4,92.07 25.4,94.62
GND  (via drill 0.51)
  Top 0.381: X5.GND@1 v10.16,22.22 X6.GND@1 13.34,22.22 13.34,19.68 | 30.48,20.95 29.21,20.95 | 29.21,20.95 25.4,20.95 25.4,22.22 | 29.21,20.95 RF1.P$17 | 30.48,20.95 34.92,20.95 RF1.P$19 34.8,21.34 34.8,23.37 35.05,23.37 | 30.48,20.95 RF1.P$18 | 25.4,26.67 25.91,26.42 RF1.P$16 25.4,26.67 | 22.23,35.81 25.65,35.81 RF1.P$13 | 25.4,30.48 25.4,35.85 RF1.P$13 | 25.4,30.48 25.4,28.75 RF1.P$14 25.91,28.7 27.94,28.7 | 25.4,36.83 25.4,36.07 RF1.P$13 | 30.1,42.54 29.21,42.54 | 29.21,42.54 RF1.P$11 28.96,42.54 | RF1.P$9 35.56,42.54 34.29,42.54 | 34.29,42.54 33.02,42.54 | 33.02,42.54 30.1,42.54 | 30.1,42.54 RF1.P$10 | 28.96,42.54 29.21,42.54 | 25.4,41.91 25.4,42.54 28.96,42.54 | 25.4,41.91 25.4,36.83 | 25.4,36.83 RF1.P$12 | 27.94,26.67 25.4,26.67 | 27.94,28.7 27.94,27.69 | 27.94,27.69 27.94,26.67 | 25.4,22.22 v20.32,22.22 X6.GND@0 17.14,22.22 17.14,19.68 | 25.4,26.67 25.4,24.76 | 25.4,24.76 25.4,22.22 | 50.8,37.08 52.83,37.08 RF1.P$34 | 50.8,27.69 50.8,37.08 | 50.8,27.69 52.83,27.69 RF1.P$29 | 50.8,37.08 50.8,39.62 50.29,40.13 46.23,40.13 46.23,42.16 RF1.P$3 | 51.05,16.51 C34.2 53.34,16.51 v53.34,20.32 53.34,20.95 | IC8.5 IC8.2 v46.99,59.69 | 42.93,23.37 42.93,21.34 RF1.P$22 | 44.96,23.37 42.93,23.37 | 44.96,23.37 44.96,21.34 RF1.P$24 | 48.51,21.34 48.51,20.95 50.8,20.95 | 53.34,20.95 55.88,20.95 C35.2 55.88,20.7 | 48.51,21.34 RF1.P$27 | 44.96,23.37 48.51,23.37 48.51,21.34 | 50.8,20.95 50.8,27.69 | 35.05,23.37 42.93,23.37 | 34.29,48.26 34.29,45.72 | 34.29,48.26 C32.2 34.04,48.26 34.29,48.26 | 34.29,42.54 34.29,45.72 | 34.29,45.72 C33.2 | 17.14,19.68 13.34,19.68 | IC7.20 111.76,31.75 115.57,31.75 | 50.8,20.95 53.34,20.95 | 142.88,45.49 IC3.4 142.88,43.81 144.78,43.81
  Top 0.381: 144.78,43.81 145.41,44.45 C7.2 | 22.23,35.81 21.59,35.81 21.59,34.92 C37.2 20.07,35.05 20.07,36.83 v17.78,36.83 | 22.23,35.81 v22.23,36.83 | 12.7,38.1 C39.2 12.7,49.53 v13.97,49.53 | 12.7,38.1 v12.7,36.19 | IC4.11 81.28,92.07 83.82,94.62 C9.2 | C11.2 83.82,67.72 | 83.82,67.72 C8.2 86.36,64.52 v88.27,64.52 | 83.82,67.72 IC4.31 v83.82,87 | 25.4,30.48 v24.77,30.48 v21.59,30.48 v17.78,30.48 | 25.4,24.76 v24.77,24.76 v21.59,24.76 | C38.2 12.7,38.1 | v33.02,43.18 33.02,42.54 | 27.69,107.95 27.3,107.95 27.3,106.04 26.92,106.04 26.92,104.14 27.3,104.14 Q2.3 26.67,103.63 26.67,103.76 25.15,103.76 25.15,102.62 D3.1 v23.88,105.41 | Q1.2 63.75,109.22 63.5,109.22 | 63.5,109.22 R3.1 | 27.69,107.95 27.69,114.3 52.07,114.3 55.24,117.47 61.59,117.47 63.5,115.57 63.5,109.22 | 27.69,107.95 R19.1 | 39.37,69.85 41.91,69.85 C27.2 | 39.37,69.85 31.75,69.85 | 39.37,89.66 IC12.4 | C40.2 39.37,80.01 37.34,80.01 | 37.34,80.01 34.29,80.01 C41.2 34.29,79.76 | 39.37,79.76 C40.2 | IC12.4 37.34,89.53 37.34,80.01 | LED2.K 44.45,109.22 41.91,106.68 41.91,95.25 v39.37,92.71 39.37,89.66 | 39.37,89.66 39.62,89.66 IC12.4 | C40.2 39.37,69.85 | JP8.8 JP8.10 50.8,56.51 52.07,57.53 C24.2 52.07,59.69 57.15,59.69 IC11.2 IC11.5 57.15,69.85 52.07,69.85 C28.2 | 21.59,59.69 22.86,59.69 23.5,59.05 27.3,59.05 27.3,60.32 26.67,60.96 IC9.2 IC9.5 | 19.05,59.69 19.05,67.31 | 19.05,67.31 19.05,69.85 21.59,69.85 C25.2 | 19.05,59.69 19.05,58.8 13.97,53.72 v13.97,49.53 | X8.3 8.26,80.01 8.26,75.56 5.08,72.39 5.08,69.85 7.62,67.31 19.05,67.31 | v13.97,49.53 v8.89,49.53 | IC10.5 IC10.2 36.83,61.72 35.05,59.94 31.75,59.94 C26.2 31.75,59.18
  Top 0.381: v17.78,41.91 v22.23,41.91 25.4,41.91 | X5.GND@3 v5.08,36.83 | 13.34,19.68 v12.7,19.05 | 17.14,19.68 v17.78,19.05 | v28.57,24.76 27.94,25.4 27.94,26.67 | 35.05,23.37 35.05,24.64 v34.92,24.76 35.05,24.89 35.05,27.18 v34.92,27.3 35.05,27.43 35.05,30.48 | 27.94,27.69 28.45,27.69 v28.57,27.5 | 27.94,28.7 27.94,29.97 28.45,30.48 v28.57,30.48 | 35.05,30.48 35.05,35.56 v34.92,35.56 | 35.05,30.48 v34.92,30.48 | 31.75,59.18 31.75,57.78 34.29,55.24 34.29,50.16 | 34.29,48.26 34.29,50.16 | 34.29,50.16 41.91,57.78 C31.2 | 19.05,59.69 21.59,59.69 | 21.59,59.69 C29.2 | C31.2 41.91,59.69 v44.32,59.69 | 41.91,59.18 C31.2 | 31.75,69.85 29.72,69.85 29.72,61.21 31.75,59.18 | 31.75,69.85 C30.2 | 144.02,81.03 144.02,67.31 142.24,67.31 C20.2 | 144.02,81.03 141.48,81.03 141.22,80.77 X4.GND | 140.97,88.9 144.02,88.9 144.02,81.03 | 140.97,88.9 140.46,89.15 X4.SHIELD@0 | S1.2 147.83,96.01 147.83,102.11 S1.1 147.96,102.87 147.96,106.68 144.15,106.68 140.97,103.5 140.97,88.9 | U$1.GND@2 79.76,100.33 C15.2 | C10.2 121.92,100.33 121.92,82.55 120.65,81.28 U$1.GND@3 | 109.86,50.8 106.68,50.8 105.41,49.53 105.41,43.18 C22.2 | Y3.GND 109.86,50.8 | 114.3,43.18 114.3,49.53 113.03,50.8 109.86,50.8 | 115.57,31.75 116.84,31.75 116.84,38.73 114.3,41.27 114.3,43.18 | 115.57,31.75 C17.2 | 114.3,43.18 C21.2 | 121.92,29.21 121.79,29.34 | 121.92,24.13 121.92,20.32 135.89,20.32 | 121.92,24.13 121.92,29.21 | U$15.1 135.89,20.32 | 121.92,29.21 R21.1 | 135.25,38.73 135.13,38.86 C4.2 | 135.25,38.73 135.25,37.08 135.89,37.08 | 135.25,38.73 132.08,38.73 v132.08,46.35 136.53,46.35 136.53,46.99 136.4,46.74 C6.2 | 144.78,43.81 144.78,38.73 142.88,38.73 143,38.86 C5.2
  Top 0.381: 135.89,20.32 BAT1.2 | 104.14,22.22 104.14,22.86 C18.2 | IC6.3 v126.36,50.16 | C12.2 67.31,53.34 66.04,52.07 X2.2 | C43.2 121.92,24.13 | 72.39,20.57 IC1.1 72.14,20.83 72.39,20.57
  Top 0.406: Y2.GND 77.47,100.33 | 77.47,100.33 C16.2 | C15.2 77.47,100.33 | U$14.1 U$15.1 135.89,37.08
  Top 0.61: C1.2 60.96,22.86 60.96,27.94 | 60.96,27.94 IC2.1 | 60.96,27.94 60.96,37.46 C2.2 61.59,37.46 | 72.39,20.57 72.39,24.13 69.85,26.67 C3.2 | U$1.GND@0 U$1.GND@1 X1.6 X1.5 v93.98,46.35 93.98,38.1 86.36,30.48 IC5.2@A | 86.36,22.22 79.38,22.22 C19.2 | IC5.2@B 86.36,22.22 | 86.36,22.22 93.98,22.22 | 93.98,22.22 104.14,22.22 | C13.2 93.98,22.22
  Bottom 0.381: X5.GND@0 X5.GND@3 X5.GND@2 X5.GND@1 | X9.3 3.17,102.23 4.45,100.97 X9.2 6.99,100.97 10.16,104.14 23.88,104.14 v23.88,105.41 31.5,111.76 43.18,111.76 LED2.K | 71.12,53.34 76.2,53.34 X2.10 | 71.12,53.34 67.31,53.34 66.04,52.07 X2.2 54.61,50.8 52.07,53.34 JP8.10 | 71.12,53.34 66.04,58.42 55.12,58.42 51.56,61.98 48.01,61.98 46.99,60.96 v46.99,59.69 v44.32,59.69 | X8.3 4.45,80.01 3.17,81.28 X8.4 | v8.89,49.53 U$2.1 | v17.78,36.83 13.21,36.83 12.7,36.32 v12.7,36.19 | 81.28,93.34 84.45,96.52 113.03,96.52 116.84,100.33 C10.2 146.05,100.33 147.32,101.6 S1.1 | 109.86,46.35 126.36,46.35 | v132.08,46.35 126.36,46.35 | U$1.GND@0 93.98,59.69 89.15,64.52 v88.27,64.52 | 88.27,16.51 X3.GND | 109.86,46.35 Y3.GND | v93.98,46.35 109.86,46.35 | v83.82,87 83.19,87 81.28,88.9 IC4.11 | v53.34,20.32 60.96,27.94 IC2.1 | 126.36,46.35 v126.36,50.16
  Bottom 0.406: Y2.GND 77.47,93.34 81.28,93.34 IC4.11
  Bottom 0.61: C3.2 IC2.1 | IC5.2@B 86.36,21.59 | 86.36,21.59 88.27,21.59 88.27,16.51 | C3.2 69.85,26.67 74.93,21.59 86.36,21.59 | C14.2 C3.2
  other vias: 50.8,13.97 124.46,2.54 102.87,13.97 54.61,2.54 147.32,2.54 3.81,13.97 15.24,5.08 15.24,13.97 36.83,13.97 25.4,13.97 3.81,110.49 15.24,121.92 57.15,121.92 104.14,121.92 147.32,121.92 34.29,121.92 82.55,121.92 129.54,16.51 100.33,2.54 123.83,77.47 8.89,92.71 17.78,80.01 8.89,102.87 100.33,22.22 140.34,73.03 135.25,75.56 113.03,31.75 31.75,76.2 36.83,71.12 19.05,64.77 41.91,78.74 58.42,82.55 53.98,101.6 123.83,53.97 120.02,46.35 120.02,41.27 147.96,20.95 102.87,114.3 139.06,30.48
  pour Top (isolate 0.61): 134.62,39.37 143.51,39.37 143.51,31.75 134.62,31.75
  pour Top (isolate 0.61, rank 2): 220.98,129.54 220.98,-5.08 27.94,-5.08 -5.08,-5.08 -5.08,129.54
  pour Bottom (isolate 0.61, rank 2): -7.62,132.08 223.52,132.08 223.52,-7.62 83.82,-7.62 60.96,-7.62 -7.62,-7.62
GPIO0
  Top 0.254: U$6.1 35.81,17.78 35.81,21.08 RF1.P$20
GPIO1
  Top 0.254: RF1.P$2 47.24,42.42 47.24,45.72 U$7.1 55.88,56.51 59.69,60.32 59.69,64.77 58.17,66.29 IC11.4
GPIO2
  Top 0.254: U$8.1 49.28,43.18 48.51,42.42 RF1.P$1
GPIO3
  Top 0.254: RF1.P$6 42.67,42.16 42.67,40.13 41.4,40.13 40.64,40.89 U$9.1 JP8.1
GPIO4
  Top 0.254: RF1.P$7 41.91,42.42 41.91,46.99 U$10.1 JP8.3
GPIO5  (via drill 0.51)
  Top 0.254: v45.21,45.72 45.21,42.42 RF1.P$4 | U$11.1 JP8.5
  Bottom 0.254: v45.21,45.72 45.72,46.23 U$11.1
GPIO6  (via drill 0.51)
  Top 0.254: U$12.1 JP8.7 | v52.83,42.16 52.83,38.35 RF1.P$35
  Bottom 0.254: v52.83,42.16 48.26,46.74 U$12.1
GPIO7
  Top 0.254: RF1.P$5 44.2,42.42 44.2,46.74 49.28,46.74 U$13.1 JP8.9
GPS_RX1  (via drill 0.51)
  Top 0.254: v56.52,36.83 55.75,36.07 53.09,36.07 RF1.P$33 | v32.26,51.05 28.96,54.36 28.96,60.45 27.69,61.72 IC9.3
  Bottom 0.254: v32.26,51.05 47.24,36.07 55.75,36.07 v56.52,36.83
GPS_TX1  (via drill 0.51)
  Top 0.254: 53.34,34.92 53.09,34.8 RF1.P$32 53.34,34.92 | v39.62,61.47 39.62,64.52 37.85,66.29 IC10.4 | v57.78,56.39 57.78,34.92 53.34,34.92
  Bottom 0.254: v39.62,61.47 44.7,56.39 v57.78,56.39
MAG_SCL  (via drill 0.51)
  Top 0.254: IC12.7 34.04,86.87 34.04,87 29.21,87 R17.1 29.21,86.36 v27.18,86.36 | X8.5 6.99,82.55 6.99,103.5 X9.4
  Bottom 0.254: v27.18,86.36 23.37,82.55 X8.5
MAG_SDA
  Top 0.254: IC12.6 24.77,88.26 24.77,87 | 24.77,87 R16.1 | 24.77,87 15.24,87 15.24,105.41 6.99,105.41 6.35,106.04 X9.6
  Bottom 0.254: X8.7 5.08,97.79 1.02,97.79 1.02,107.31 3.81,107.31 X9.6
MAG_VCC  (via drill 0.51)
  Top 0.381: IC12.8 34.29,85.72 | 34.29,85.72 34.29,83.19 | 34.29,83.19 C41.1 | 29.21,83.19 25.4,83.19 25.02,83.57 24.77,83.57 | IC12.5 36.2,89.53 36.2,85.72 34.29,85.72 | 34.29,83.19 29.21,83.19 | 29.21,83.19 R17.2 | JP10.2 1.02,72.64 1.02,83.82 | X8.6 1.02,83.82 | 1.02,83.82 1.02,104.78 X9.5 | v7.62,71.12 14.61,71.12 24.77,81.28 24.77,83.57 | 24.77,83.57 R16.2
  Bottom 0.381: JP10.2 v7.62,71.12
N$1
  Top 0.254: 73.66,100.33 C16.1
  Top 0.406: IC4.13 76.2,92.71 74.93,93.98 Y2.2 73.66,97.16 73.66,100.33
N$2
  Top 0.254: 81.28,100.33 C15.1
  Top 0.406: IC4.12 78.74,92.71 80.01,93.98 Y2.1 81.28,97.16 81.28,100.33
N$3
  Top 0.254: LED1.A R1.1
N$4  (via drill 0.51)
  Top 0.254: v58.42,102.87 64.77,102.87 Q1.3
  Bottom 0.254: LED1.K 52.07,109.22 v58.42,102.87
N$5
  Top 0.254: 138.94,44.96 137.79,43.81 Y1.2 135.38,41.91 | 138.94,44.96 139.06,45.08 IC3.1 | IC3.1 139.06,45.72 | 135.38,41.91 135.25,41.91 135.25,41.27 | 135.38,41.91 135.38,41.4 C4.1 | 138.94,44.96 138.94,45.47 IC3.1
N$6
  Top 0.381: JP2.1 U$1.ISP_VCC
N$7
  Top 0.254: IC7.3 109.22,43.18 C22.1 107.91,47.67 Y3.2
N$8
  Top 0.254: LED2.A R2.1
N$9
  Top 0.254: 146.05,37.85 146.18,37.97 | 146.18,37.97 146.56,38.35 R9.1 | D2.3 140.97,27.94 140.97,29.21 142.24,30.48 144.78,30.48 144.78,36.83 146.05,38.1 146.18,37.97
N$11
  Top 0.254: IC3.3 141.6,48.26 143.13,48.26 144.15,49.28 145.41,49.28 | 145.41,49.53 144.78,49.53 C7.1 145.41,49.53 | 147.32,41.91 146.69,41.91 R9.2 147.32,41.91 | 147.32,41.91 147.32,49.53 145.41,49.53 | 147.32,41.91 148.59,41.91 148.59,34.29 147.32,34.29 R8.2
  Top 0.381: 145.41,49.28 145.41,49.53
N$12
  Top 0.254: IC3.2 Y1.1 140.46,41.91 | IC3.2 140.34,45.72 | 140.46,41.91 142.75,41.91 | 142.75,41.91 142.88,41.91 142.88,41.27 | 142.75,41.91 142.75,41.4 C5.1 | 140.46,41.91 140.46,45.47 IC3.2
N$14
  Top 0.61: JP4.1 86.36,38.1 83.82,35.56 IC5.3@A
  Bottom 0.61: C14.1 83.82,30.48 IC5.3@A
N$15
  Top 0.254: JP5.2 88.9,43.81 C23.1
N$18
  Top 0.254: IC7.2 110.49,43.18 C21.1 111.81,47.67 Y3.1
N$22
  Top 0.254: 48.26,71.12 48.01,70.87 IC8.4 | 48.26,71.12 JP6.2 | 48.26,71.12 R11.1
N$23
  Top 0.762: 17.02,27.94 C36.2
  Top 0.813: X5.SIG 12.19,27.94
  Top 1.016: X6.SIGNAL 15.24,27.94
  Top 1.524: 15.24,27.94 L3.2
  Top 2.311: 12.19,27.94 15.24,27.94 17.02,27.94
N$24
  Top 0.66: 22.61,27.94 22.86,27.65 RF1.P$15
  Top 0.762: 21.08,27.94 C36.1
  Top 2.311: 22.61,27.94 21.08,27.94
N$25
  Top 0.254: IC10.3 37.85,58.67 38.1,58.42 R13.2
N$26
  Bottom 0.381: JP11.2 1.02,62.48 1.02,86.36 X8.8
N$29
  Top 0.254: 31.11,107.95 31.11,104.14 Q2.1 | 31.11,107.95 31.11,113.03 49.53,113.03 55.88,106.68 55.88,94.62 R18.2 | 31.11,107.95 R19.2
PPS  (via drill 0.51)
  Top 0.254: IC11.3 58.17,61.85 58.42,61.59 v58.42,60.96 | v62.23,99.06 v62.23,60.96
  Bottom 0.254: v62.23,60.96 v58.42,60.96 | v62.23,99.06 66.67,103.5 99.06,103.5 JP9.2
SLEEP_FLAG
  Top 0.254: U$5.1 41.66,17.78 41.66,21.08 RF1.P$21
SQW
  Top 0.254: JP3.2 127,66.04 | 127,66.04 127,66.67 128.91,66.67 R4.1 | 127,66.04 127,62.23 124.46,59.69 124.46,57.78 126.36,55.88 137.16,55.88 140.34,52.7 140.34,51.31 140.21,51.05 IC3.7
USB_D+  (via drill 0.6)
  Top 0.254: IC7.19 v110.49,20.32
  Bottom 0.254: X3.D+ 90.81,16.51 90.81,20.32 v110.49,20.32
USB_D-  (via drill 0.6)
  Top 0.254: v109.22,19.05 IC7.18
  Bottom 0.254: X3.D- 91.42,13.94 92.71,15.24 92.71,17.78 93.98,19.05 v109.22,19.05
V_ANT
  Top 0.381: L3.1 15.24,34.92 | 15.24,34.92 15.24,37.87 C38.1 15.24,38.1 C39.1 | C37.1 15.24,34.92
  Bottom 0.381: JP7.2 4.06,44.7 13.72,44.7 C39.1
V_BACKUP
  Top 0.254: DP1.3 115.57,10.16 111.76,6.35 101.6,6.35 97.79,2.54 58.42,2.54 50.8,10.16 46.48,10.16 43.94,12.7 43.94,21.08 RF1.P$23
VBATT  (via drill 0.51)
  Top 0.254: 118.11,24.76 118.11,18.16 122.3,13.97 | 118.11,24.76 116.59,24.76 DP1.1 | v105.41,53.34 113.03,53.34 118.11,48.26 118.11,24.76 | 122.3,13.97 137.16,13.97 139.7,11.43 144.78,11.43 146.05,12.7 146.05,26.92 | 122.3,13.97 BAT1.1 | D2.1 146.05,26.92 | R8.1 147.32,31.52 147.32,26.92 146.05,26.92
  Bottom 0.254: X1.2 86.36,53.34 100.33,53.34 101.6,52.07 104.14,52.07 v105.41,53.34
VBUS  (via drill 0.51)
  Top 0.381: L2.1 76.2,15.24 | 79.38,15.24 C19.1
  Top 0.61: 76.2,15.24 77.72,15.24 | 77.72,15.24 79.38,15.24 | v80.01,12.7 80.01,13.33 v77.72,13.33 77.72,15.24
  Bottom 0.381: 88.27,13.33 X3.VBUS
  Bottom 0.61: 88.27,13.33 87.63,12.7 v80.01,12.7 77.72,12.7 v77.72,13.33
VCC  (via drill 0.51)
  Top 0.381: IC7.1 111.76,34.29 | 111.76,34.29 111.76,33.65 99.06,33.65 98.55,34.16 v98.55,39.37 98.55,41.78 97.79,42.54 97.79,43.18 R10.2 | 111.76,34.29 115.57,34.29 C17.1 | 25.65,67.31 v24.13,67.31 21.59,67.31 C25.1 | IC10.1 31.75,63.12 C26.1 v31.75,64.26 | IC8.6 46.1,66.42 | IC8.6 43.43,66.42 | 43.43,66.42 41.91,66.42 C27.1 | IC11.1 56.13,62.86 52.07,62.86 | 52.07,62.86 C24.1 | IC12.1 39.37,85.72 39.37,83.19 | 39.37,83.19 C40.1 | IC3.8 136.53,50.88 C6.1 136.4,50.04 135.89,49.53 132.08,49.53 129.54,46.99 129.54,41.91 | IC9.6 25.65,67.31 | 25.65,67.31 25.65,71.12 R12.2 | v52.07,64.26 52.07,62.86 | 50.8,100.08 51.56,100.08 | 50.8,100.08 45.72,100.08 R2.2 | 50.8,100.08 R1.2 51.56,100.08 | IC8.6 45.97,71.12 R11.2 45.09,71.12 45.09,83.19 | 45.09,83.19 48.26,83.19 R14.2 48.26,83.82 51.56,83.82 51.56,100.08 | 45.09,83.19 44.45,83.57 R15.2 44.45,83.19 39.37,83.19 | 43.43,66.42 v43.43,65.53 | C20.1 142.24,70.1 137.92,70.1 R5.2 137.67,70.1 | 137.67,70.1 137.67,83.06 140.97,83.06 X4.VDD | JP2.2 116.84,97.79 C10.1 | 133.35,70.1 129.03,70.1 R4.2 128.78,70.1 128.27,70.61 128.27,93.98 | 128.27,93.98 128.27,95.76 128.78,96.27 R7.2 | D1.3 v125.73,93.98 128.27,93.98 | 133.35,70.1 137.67,70.1 | 133.35,70.1 R6.2 | 74.93,69.85 74.93,65.41 79.38,65.41 83.82,60.96 U$1.IOREF 83.82,57.15 80.01,53.34 80.01,46.99 76.2,43.18 JP1.2 | IC4.10 83.82,89.53 82.55,88.26 82.55,78.74 81.28,77.47 74.93,77.47 74.93,69.85 | 74.93,69.85 L1.2 | 129.54,41.91 129.54,39.37 | 129.54,39.37 D4.3 | v127,39.37 129.54,39.37 | X2.4 v68.58,59.69 | IC6.1 124.46,44.07 124.46,41.91 129.54,41.91
  Top 0.406: IC4.10 83.82,90.81 85.72,92.71 v88.9,92.71 88.9,94.62 C9.1
  Bottom 0.381: v24.13,67.31 27.18,64.26 v31.75,64.26 43.43,64.26 | 43.43,64.26 v52.07,64.26 56.64,59.69 v68.58,59.69 74.93,59.69 76.2,60.96 83.82,60.96 U$1.IOREF | v43.43,65.53 43.43,64.26 | v125.73,93.98 121.92,97.79 C10.1 | 98.55,36.83 v98.55,39.37 v127,39.37 | JP1.2 76.2,36.83 | JP2.2 90.17,93.98 v88.9,92.71
  Bottom 0.61: 76.2,36.83 98.55,36.83
VIN
  Top 0.381: U$1.VIN 101.09,58.42 103.63,55.88 106.68,55.88 107.95,54.61 114.3,54.61 121.92,46.99 121.92,35.56 R20.1 | C42.1 36.83,105.41 38.1,106.68 X7.1
  Top 0.61: 93.98,28.57 C13.1 93.98,26.67 | U$1.VIN X1.7 99.06,48.89 95.25,45.08 95.25,29.84 93.98,28.57 | 93.98,28.57 IC5.1@A
  Bottom 0.381: JP11.1 3.81,63.5 10.16,69.85 10.16,73.03 | 10.16,73.03 5.71,73.03 2.54,76.2 X8.2 | 10.16,73.03 17.78,73.03 25.4,80.64 31.11,80.64 | X7.1 38.1,100.33 31.11,100.33 | 31.11,100.33 8.51,100.33 7.49,99.31 2.79,99.31 2.54,99.57 X9.1 | 31.11,100.33 31.11,80.64 | U$1.VIN 99.06,59.69 92.71,66.04 C12.1 45.72,66.04 31.11,80.64

## Text on the board
tPlace: TX1 | RX1 | TX0 | RX0 | TX1 | RX1 | SDA | SCL
tNames: S/N: | v1.0.1 | RESET | CLOCK: | BOOTLOADER:
tValues: FAN | POWER | STATUS | + - | D7/D6 | 5V / LINK | D6/D15 | 3V3/VIN | 3V3/5V | AUTO / RESET | GPS / ANTENNA | MHz | USB
_tsilk: PoE magnetometer v1.0 | 4 | 3 | 2 | SCL | SDA | AREF | GND | 13 | 12 | 11 | 10 | 9 | 8 | 7 | 6 | 5 | 1 | 0 | 22 | 23 | NC | NC | 3 | 2 | 20 | 21 | ISP / IOREF | MICRO SD: 3V3 / operation only | GPS / RESET | NC | IOREF | !RESET | 3V3 | 5V | GND | GND | Vin | A0 | A1 | A2 | A3 | A4 | A5 | A6 | A7 | 14 | 15 | 16 | 17 | 18 | 19 | 20 | 21 | 5V | 3V3 | IC8 - IC11 / 74LVC1T45 | GND | 3 / H | 4 / H | 5 / H | 6 / L | 7 / L | GPIO 1 | GPIO 2 | MCU | PWR SRC | GPIO / 0 | SLEEP / FLAG
_bsilk: PoE magnetometer v1.0